# EasyEDA Pro project ProPrj_NRF9151 GILBERTO8_2026-06-28.epro, board PCB1
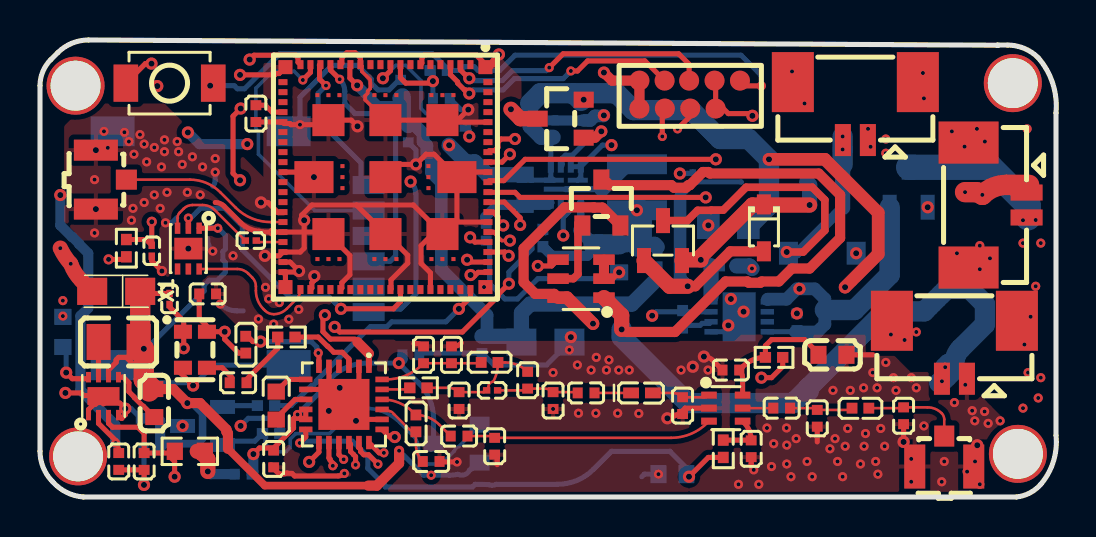
[diagram p2: board, top side]
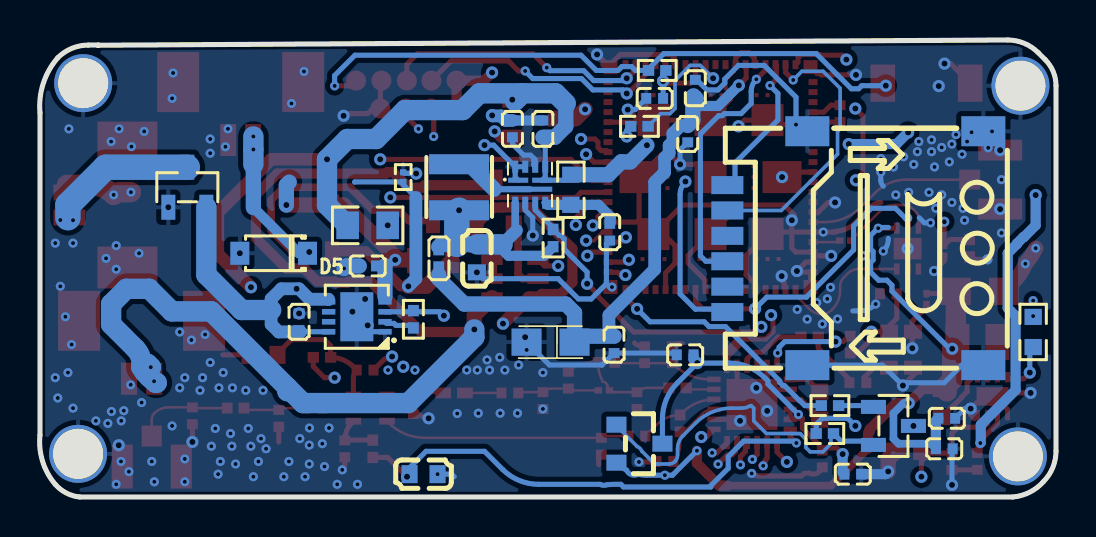
[diagram p3: board, bottom side, seen from below]

Outline 50.8 x 22.86 mm; copper layers: Top Layer, Inner1, Inner2, Bottom Layer. Coordinates in mm from the lower left corner of the outline.
Outline path: 0,20.57 0,2.3 arc(0.17,1.47) 0.64,0.76 arc(1.33,0.23) 2.17,0 48.81,0 arc(49.49,0.2) 50.04,0.64 arc(50.67,1.78) 50.8,3.09 50.8,19.21 arc(50.64,20.68) 49.91,21.97 arc(49.21,22.44) 48.38,22.61 47.88,22.61 47.9,22.6 2.42,22.86 arc(1.59,22.69) 0.89,22.23 0.54,21.88 arc(0.14,21.28) 0,20.57
Stack: Top Layer 0.035mm Outer layer thickness 1oz / Dielectric1 0.2104mm 7628 RC49% 8.6mil / Inner1 0.0152mm Inner layer thickness / Dielectric2 1.065mm 1.1mm H/HOZ Copper / Inner2 0.0152mm Inner layer thickness / Dielectric3 0.2104mm 7628 RC49% 8.6mil / Bottom Layer 0.035mm Outer layer thickness 1oz

## Design rules (mm)
spacing copperThickness1oz (default): track to track 0.102, other pairs 0.094 to 0.3
spacing copperThickness2oz: track to track 0.203, other pairs 0.152 to 0.3
spacing Plane_innerPlane: track to track 0.102, other pairs 0.094 to 0.3
spacing Copper_copperRegion: track to track 0.102, other pairs 0.094 to 0.3
track width copperThickness1oz (default): min 0.127, default 0.254, max 2.54
track width copperThickness2oz: min 0.203, default 0.254, max 2.54
differential pair differentialPair (default): width min 0.127, default 0.254, max 2.54; gap min 0.152, default 0.152
region e1 uses Copper_copperRegion
region e2 uses Copper_copperRegion
region e3 uses Copper_copperRegion
region e4 uses Copper_copperRegion
region e5 uses Copper_copperRegion
region e6 uses Copper_copperRegion
region e7 uses Copper_copperRegion
region e8 uses Copper_copperRegion
region e9 uses Copper_copperRegion
pour e1500 uses Copper_copperRegion
pour e1553 uses Copper_copperRegion
pour e1578 uses Copper_copperRegion
pour e1617 uses Copper_copperRegion
pour e1636 uses Copper_copperRegion

## Placement (name value [footprint] x y rotation side)
C3  15pF  [C0402]  18.03 20.45 270 bottom
C7  10uF  [C0402]  25.65 18.42 270 bottom
C12  10nF  [C0402]  27.18 18.42 270 bottom
C13  10uF  [C0402]  3.94 1.78 90 top
C14  22uF  [C0603]  28.96 11.94 90 bottom
C15  22uF  [C0603]  5.71 4.7 270 top
C17  10nF  [C0402]  5.21 1.78 90 top
C18  10uF  [C0402]  22.31 13.25 90 bottom
C41  10uF  [C0402]  34.42 11.56 180 bottom
C42  10uF  [C0402]  37.85 8.76 270 bottom
C43  10uF  [C0402]  18.54 7.11 0 bottom
C44  100nF  [C0402]  20.07 19.94 180 bottom
C45  4.7uF  [C0402]  10.8 19.18 90 top
C46  4.7uF  [C0402]  22.1 7.62 270 bottom
C47  4.7uF  [C0402]  5.46 3.94 180 bottom
C48  100nF  [C0402]  5.59 2.41 0 bottom
C49  100nF  [C0402]  18.42 18.16 90 bottom
C50  10uF  [CASE-A_3216]  25.27 7.75 0 bottom
C51  10uF  [CASE-A_3216]  3.81 10.29 180 top
C52  15pF  [C0201]  10.54 12.83 0 top
C53  100nF  [C0201]  5.59 12.32 270 top
C54  100nF  [C0201]  6.48 9.91 270 top
C56  1nF  [C0402]  8.38 10.16 0 top
C57  100nF  [C0402]  11.68 1.91 270 top
C76  1nF  [C0402]  20.95 4.83 90 top
C81  1nF  [C0402]  22.73 2.54 90 top
C83  1nF  [C0402]  35.56 2.41 90 top
C85  1nF  [C0402]  34.54 6.35 0 top
C88  10pF  [C0402]  9.91 5.72 0 top
C89  470nF  [C0402]  10.16 1.14 0 bottom
C90  47nF  [C0402]  19.18 7.11 270 top
C91  47pF  [C0402]  20.57 7.11 270 top
C92  3pF  [C0402]  24.38 5.84 270 top
C93  5.6pF  [C0402]  25.65 4.83 90 top
C94  39pF  [C0402]  27.3 5.21 0 top
C95  1.8pF  [C0402]  32.13 4.57 90 top
C96  1.8pF  [C0402]  19.56 1.78 180 top
C97  2.4pF  [C0402]  20.95 3.05 0 top
C98  39pF  [C0402]  37.08 4.45 0 top
C99  3.3pF  [C0402]  38.86 3.94 90 top
C100  3.3pF  [C0402]  43.18 4.06 90 top
C101  NC  [C0603]  31.62 1.14 180 bottom
C102  NC  [C0603]  39.62 7.11 180 top
CARD2  SNO-1305-B  [SIM-SMD_SIM-1305-6P]  10.03 12.45 90 bottom
CN4  A1251WV-S-2P  [CONN-SMD_2P-P1.25_A1251WV-S-2P]  47.88 14.61 270 top
CN5  A1251WV-S-2P  [CONN-SMD_2P-P1.25_A1251WV-S-2P]  40.77 19.3 180 top
CN6  A1251WV-S-2P  [CONN-SMD_2P-P1.25_A1251WV-S-2P]  45.72 7.37 180 top
D5  MBR120LSF  [SOD-123_L2.8-W1.8-LS3.7-RD]  39.12 12.19 0 bottom
D6  BZT52C7V5S  [SOD-323_L1.8-W1.3-LS2.5-RD]  36.2 13.46 270 top
L3  1uH  [IND-SMD_L3.0-W3.0_SWPA3010S]  29.84 15.49 90 bottom
L4  2.2uH  [L0806]  3.93 7.76 180 top
L20  47nH  [L0402]  22.48 6.73 180 top
L21  2.5nH  [L0201]  22.61 5.33 0 top
L22  4.7nH  [L0402-R-RD]  30.1 5.21 0 top
L23  15nH  [L0402]  18.8 3.68 90 top
L24  9.1nH  [L0402]  41.02 4.45 0 top
L26  CBW100505U101T  [L0402]  10.29 7.62 90 top
L27  CBW100505U101T  [L0402]  30.86 11.94 90 bottom
NOREF  -  [Pad_e294]  1.78 20.57 0 top
NOREF#2  -  [Pad_e296]  48.89 2.16 0 top
NOREF#3  -  [Pad_e295]  1.9 2.03 0 top
NOREF#4  -  [Pad_e297]  48.64 20.7 0 top
Q1  AO3407A  [SOT-23_L2.9-W1.3-P1.90-LS2.4-BR]  28.07 14.73 270 top
Q2  AO3407A  [SOT-23_L2.9-W1.3-P1.90-LS2.4-BR]  26.04 18.92 0 top
Q3  AO3407A  [SOT-23_L2.9-W1.3-P1.90-LS2.4-BR]  20.83 2.67 0 bottom
Q6  SI2301  [SOT-23-3_L2.9-W1.3-P1.90-LS2.4-BR]  31.15 12.83 270 top
Q7  MMBT3904  [SOT-23-3_L2.9-W1.3-P1.90-LS2.4-BR]  8.13 3.56 0 bottom
Q8  SI2301  [SOT-23-3_L2.9-W1.3-P1.90-LS2.4-BR]  43.43 15.49 270 bottom
R8  100kΩ  [R0603]  1.14 8.26 270 bottom
R9  100kΩ  [R0603]  24.26 15.37 90 bottom
R11  10kΩ  [R0402]  25.15 12.95 90 bottom
R13  100kΩ  [R0603]  7.49 2.29 0 top
R46  10kΩ  [R0201]  32.64 16 90 bottom
R47  2kΩ  [R0402]  32.13 8.89 270 bottom
R48  470kΩ  [R0805]  34.42 13.59 0 bottom
R49  2.2kΩ  [R0402]  11.3 4.57 180 bottom
R50  22kΩ  [R0402]  11.56 3.17 0 bottom
R51  2kΩ  [R0402]  19.94 21.34 180 bottom
R52  1MΩ  [R0402]  4.32 12.45 270 top
R53  10kΩ  [R0402]  20.83 18.54 180 bottom
R57  220Ω  [R0402]  12.32 8 0 top
R58  0Ω  [R0402]  18.92 5.46 0 top
R59  100Ω  [R0402]  36.7 6.98 180 top
R60  100Ω  [R0402]  34.16 2.41 90 top
RF2  6GHz  [RF-SMD_FRF05002-JSS103M]  3.56 15.88 90 top
RF3  6GHz  [RF-SMD_FRF05002-JSS103M]  45.21 2.29 180 top
SW2  TS-1088-AR02016  [SW-SMD_L3.9-W3.0-P4.45]  6.48 20.7 180 top
U1  nRF9151-LACA-R7  [LGA-113_L12.1-W11.1_NRF9151-LACA-R7]  17.27 16 270 top
U5  LTC4412IS6#TRPBF  [SOT-23-6_L2.9-W1.6-P0.95-LS2.8-BL]  27.05 10.92 90 top
U8  SKY65723-81  [MCM-6_L2.3-W1.7-P0.54-TL-EP]  7.42 12.43 270 top
U9  TPS6209733RWKR  [VQFN-11_L2.0-W2.0-P0.50-TL_TI_RWK]  26.29 15.62 180 bottom
U10  TPS62172DSGR  [WSON-8_L2.0-W2.0-P0.50-TL-EP]  3.17 5.05 90 top
U11  CN3165  [DFN-8_L3.0-W3.0-P0.50-BL-EP]  34.96 9.02 90 bottom
U13  SX1262IMLTRT  [QFN-24_L4.0-W4.0-P0.50-BL-EP2.6]  15.2 4.63 180 top
U14  PE4259-63  [SC-70-6_L2.2-W1.3-P0.65-LS2.1-BL]  34.29 4.45 270 top
U15  15uH  [L0603]  11.81 4.57 90 top
U16  e0493c80bb4246c1b3dcb26663821a15  [J CONNEXCO]  28.7 20.83 0 top
X1  32MHz  [OSC-SMD_4P-L2.0-W1.6-BL_1XXD]  7.75 7.37 270 top

## Footprints (pads in the part's own frame, mm; a bottom-side part is the same pattern mirrored in y, then rotated)
C0201
  rect 0.368x0.324 smd: 1(-0.275,0) 2(0.275,0)
C0402
  rect 0.5x0.54 smd: 1(-0.42,0) 2(0.42,0)
C0603
  rect 0.8x0.9 smd: 1(-0.7,0) 2(0.7,0)
CASE-A_3216
  rect 1.5x1.359 smd: 1(-1.2,0) 2(1.2,0)
CONN-SMD_2P-P1.25_A1251WV-S-2P
  rect 0.8x1.6 smd: 1(-0.626,1.45) 2(0.624,1.45)
  rect 2.1x3 smd: 3(-3.125,-1.45) 4(3.125,-1.45)
DFN-8_L3.0-W3.0-P0.50-BL-EP
  rect 0.28x0.665 smd: 1(-0.75,-1.407) 2(-0.25,-1.407) 3(0.25,-1.407) 4(0.75,-1.407) 5(0.75,1.407) 6(0.25,1.407) 7(-0.25,1.407) 8(-0.75,1.407)
  rect 2.45x1.65 smd: 9(0,0)
IND-SMD_L3.0-W3.0_SWPA3010S
  rect 1x3 smd: 1(1.15,0) 2(-1.15,0)
J CONNEXCO
  round 1 smd: 1(1.27,0) 2(2.529,0) 3(3.756,0) 4(5.026,0) 5(6.295,0) 6(1.27,-1.397) 7(2.54,-1.397) 8(3.81,-1.397) 9(5.08,-1.397)
L0201
  rect 0.368x0.324 smd: 1(-0.275,0) 2(0.275,0)
L0402
  rect 0.54x0.54 smd: 1(-0.42,0) 2(0.42,0)
L0402-R-RD
  rect 0.79x0.54 smd: 1(-0.545,0) 2(0.545,0)
L0603
  rect 0.8x0.864 smd: 1(-0.7,0) 2(0.7,0)
L0806
  rect 1.2x1.8 smd: 1(-1,0) 2(1,0)
LGA-113_L12.1-W11.1_NRF9151-LACA-R7
  rect 0.7x0.7 smd: 1(-5.5,5) 20(-5.5,-5) 41(5.5,-5) 60(5.5,5)
  rect 0.45x0.3 smd: 2(-5.625,4.25) 3(-5.625,3.75) 4(-5.625,3.25) 5(-5.625,2.75) 6(-5.625,2.25) 7(-5.625,1.75) 8(-5.625,1.25) 9(-5.625,0.75) 10(-5.625,0.25) 11(-5.625,-0.25) 12(-5.625,-0.75) 13(-5.625,-1.25) 14(-5.625,-1.75) 15(-5.625,-2.25) 16(-5.625,-2.75) 17(-5.625,-3.25) 18(-5.625,-3.75) 19(-5.625,-4.25) 42(5.625,-4.25) 43(5.625,-3.75) 44(5.625,-3.25) 45(5.625,-2.75) 46(5.625,-2.25) 47(5.625,-1.75) 48(5.625,-1.25) 49(5.625,-0.75) 50(5.625,-0.25) 51(5.625,0.25) 52(5.625,0.75) 53(5.625,1.25) 54(5.625,1.75) 55(5.625,2.25) 56(5.625,2.75) 57(5.625,3.25) 58(5.625,3.75) 59(5.625,4.25)
  rect 0.3x0.45 smd: 21(-4.75,-5.125) 22(-4.25,-5.125) 23(-3.75,-5.125) 24(-3.25,-5.125) 25(-2.75,-5.125) 26(-2.25,-5.125) 27(-1.75,-5.125) 28(-1.25,-5.125) 29(-0.75,-5.125) 30(-0.25,-5.125) 31(0.25,-5.125) 32(0.75,-5.125) 33(1.25,-5.125) 34(1.75,-5.125) 35(2.25,-5.125) 36(2.75,-5.125) 37(3.25,-5.125) 38(3.75,-5.125) 39(4.25,-5.125) 40(4.75,-5.125) 61(4.75,5.125) 62(4.25,5.125) 63(3.75,5.125) 64(3.25,5.125) 65(2.75,5.125) 66(2.25,5.125) 67(1.75,5.125) 68(1.25,5.125) 69(0.75,5.125) 70(0.25,5.125) 71(-0.25,5.125) 72(-0.75,5.125) 73(-1.25,5.125) 74(-1.75,5.125) 75(-2.25,5.125) 76(-2.75,5.125) 77(-3.25,5.125) 78(-3.75,5.125) 79(-4.25,5.125) 80(-4.75,5.125)
  rect 0.2x0.2 smd: 81(-4.1,3.4) 82(-4.1,2.85) 83(-4.1,2.3) 84(-4.1,0.55) 85(-4.1,0) 86(-4.1,-0.55) 87(-4.1,-2.3) 88(-4.1,-2.85) 89(-4.1,-3.4) 90(-0.55,-2.15) 91(0,-2.15) 92(0.55,-2.15) 93(4.1,-3.4) 94(4.1,-2.85) 95(4.1,-2.3) 96(4.1,-0.55) 97(4.1,0) 98(4.1,0.55) 99(4.1,2.3) 100(4.1,2.85) 101(4.1,3.4) 102(0.55,2.15) 103(0,2.15) 104(-0.55,2.15)
  rect 1.6x1.6 smd: 105(-2.85,2.85) 106(-2.85,0) 107(-2.85,-2.85) 109(2.85,-2.85) 110(2.85,0) 111(2.85,2.85) 113(0,0)
  rect 1.6x1.95 smd: 108(0,-3.575) 112(0,3.575)
MCM-6_L2.3-W1.7-P0.54-TL-EP
  rect 0.56x0.275 smd: 1(-1.02,0.54) 2(-1.02,0) 3(-1.02,-0.54) 4(1.02,-0.54) 5(1.02,0) 6(1.02,0.54)
  rect 1.08x1.4 smd: 7(0,0)
OSC-SMD_4P-L2.0-W1.6-BL_1XXD
  rect 0.7x0.9 smd: 1(-0.9,-0.6) 2(0.9,-0.6) 3(0.9,0.6) 4(-0.9,0.6)
Pad_e294
  round 2.901 hole 2.499: 1(0,0)
Pad_e295
  round 2.9 hole 2.5: 2(0,0)
Pad_e296
  round 2.901 hole 2.499: 3(0,0)
Pad_e297
  round 2.901 hole 2.499: 4(0,0)
QFN-24_L4.0-W4.0-P0.50-BL-EP2.6
  rect 0.28x0.665 smd: 1(-1.25,-1.907) 2(-0.75,-1.907) 3(-0.25,-1.907) 4(0.25,-1.907) 5(0.75,-1.907) 6(1.25,-1.907) 13(1.25,1.907) 14(0.75,1.907) 15(0.25,1.907) 16(-0.25,1.907) 17(-0.75,1.907) 18(-1.25,1.907)
  rect 0.665x0.28 smd: 7(1.907,-1.25) 8(1.907,-0.75) 9(1.907,-0.25) 10(1.907,0.25) 11(1.907,0.75) 12(1.907,1.25) 19(-1.907,1.25) 20(-1.907,0.75) 21(-1.907,0.25) 22(-1.907,-0.25) 23(-1.907,-0.75) 24(-1.907,-1.25)
  rect 2.55x2.55 smd: 25(0,0)
R0201
  rect 0.303x0.324 smd: 1(-0.241,0) 2(0.241,0)
R0402
  rect 0.566x0.54 smd: 1(-0.433,0) 2(0.433,0)
R0603
  rect 0.806x0.864 smd: 1(-0.753,0) 2(0.753,0)
R0805
  rect 1.133x1.377 smd: 1(-1,0) 2(1,0)
RF-SMD_FRF05002-JSS103M
  rect 1x1.05 smd: 1(0,-0.762)
  rect 1.05x2.2 smd: 2(-1.475,0.762) 3(1.475,0.762)
SC-70-6_L2.2-W1.3-P0.65-LS2.1-BL
  rect 0.35x0.78 smd: 1(-0.65,-0.84) 2(0,-0.84) 3(0.65,-0.84) 4(0.65,0.84) 5(0,0.84) 6(-0.65,0.84)
SIM-SMD_SIM-1305-6P
  rect 1.5x2.2 smd: 7(-5.85,2.401) 8(5.85,2.401) 9(5.85,-6.399) 10(-5.85,-6.399)
  rect 0.9x1.6 smd: C1(-3.193,6.399) C2(-0.653,6.399) C3(1.887,6.399) C5(-1.923,6.399) C6(0.617,6.399) C7(3.156,6.399)
SOD-123_L2.8-W1.8-LS3.7-RD
  rect 0.95x1.15 smd: 1(-1.692,0) 2(1.692,0)
SOD-323_L1.8-W1.3-LS2.5-RD
  rect 1x0.7 smd: 1(-1.173,0) 2(1.173,0)
SOT-23-3_L2.9-W1.3-P1.90-LS2.4-BR
  rect 1.25x0.7 smd: 1(1,-0.95) 2(1,0.95) 3(-1,0)
SOT-23-6_L2.9-W1.6-P0.95-LS2.8-BL
  rect 0.532x1.072 smd: 1(-0.95,-1.149) 2(0,-1.149) 3(0.95,-1.149) 4(0.95,1.149) 5(0,1.149) 6(-0.95,1.149)
SOT-23_L2.9-W1.3-P1.90-LS2.4-BR
  rect 1x0.8 smd: 1(1.15,-0.95) 2(1.15,0.95) 3(-1.15,0)
SW-SMD_L3.9-W3.0-P4.45
  rect 1.23x1.86 smd: 1(-2.185,0) 2(2.185,0)
VQFN-11_L2.0-W2.0-P0.50-TL_TI_RWK
  rect 1x0.25 smd: 1(-0.6,0.225) 7(0.6,0.225)
  rect 2.2x0.25 smd: 2(0,-0.225)
  rect 0.3x0.6 smd: 3(-0.75,-0.9) 4(-0.25,-0.9) 5(0.25,-0.9) 6(0.75,-0.9) 8(0.75,0.9) 9(0.25,0.9) 10(-0.25,0.9) 11(-0.75,0.9)
WSON-8_L2.0-W2.0-P0.50-TL-EP
  rect 0.521x0.25 smd: 1(-0.95,0.75) 2(-0.95,0.25) 3(-0.95,-0.25) 4(-0.95,-0.75) 5(0.95,-0.75) 6(0.95,-0.25) 7(0.95,0.25) 8(0.95,0.75)
  rect 0.9x1.6 smd: 9(0,0)

## Nets
As in the schematic, except:
GND: C3.1 C7.1 C12.1 C13.1 C14.1 C17.1 C18.1 C41.1 C42.1 C43.2 C44.1 C45.1 C46.2 C47.2 C48.1 C49.1 C50.2 C51.2 C53.2 C54.2 C56.2 C57.2 C76.1 C81.1 C83.1 C85.1 C89.1 C90.1 C91.1 C93.1 C95.1 C96.1 C99.1 C100.1 C101.2 C102.1 CARD2.7 CARD2.8 CARD2.9 CARD2.10 CARD2.C5 CN4.1 CN4.3 CN4.4 CN5.1 CN5.3 CN5.4 CN6.1 CN6.3 CN6.4 D5.2 NOREF.1 NOREF#2.3 NOREF#3.2 NOREF#4.4 Q7.3 Q8.1 R13.2 R46.2 R47.1 R52.2 RF2.2 RF2.3 RF3.2 RF3.3 SW2.2 U1.1 U1.7 U1.13 U1.15 U1.20 U1.25 U1.30 U1.34 U1.36 U1.38 U1.39 U1.40 U1.41 U1.43 U1.46 U1.51 U1.55 U1.60 U1.66 U1.71 U1.76 U1.105 U1.106 U1.107 U1.108 U1.109 U1.110 U1.111 U1.112 U1.113 U5.2 U5.3 U8.7 U9.1 U9.4 U9.10 U9.11 U10.1 U10.4 U10.9 U11.1 U11.3 U11.9 U13.2 U13.5 U13.8 U13.20 U13.25 U14.2 U16.4 U16.9 X1.1 X1.2

Pads without a net: CARD2 C6; U1 2 5 6 8 11 12 21 22 23 26 27 28 29 31 32 33 44 45 47 48 49 50 53 54 56 57 58 74 75 77 78 79 80 81 82 83 84 85 86 87 88 89 90 91 92 93 94 95 96 97 98 99 100 101 102 103 104; U8 4 5; U11 6 7; U13 4

## Via types
v1: diameter 0.61, hole 0.305, Top Layer to Bottom Layer, 105 vias
v2: diameter 0.457, hole 0.203, Top Layer to Bottom Layer, 176 vias
v3: diameter 0.508, hole 0.254, Top Layer to Bottom Layer, 3 vias

## Routing (per net, layer and track width the routed paths; a pad name or vN(x,y) marks a point on that pad's centre or on a via; arc(x,y) is an arc through that point)
3.3V_SYS_2A: length 64.7
  Top Layer w0.254: v1(10.03,19.43) 9.65,19.05 9.65,16.19 v1(10,15.84)
  Top Layer w0.508: v1(28.2,21.23) 28.6,20.83 U16.1 U16.6
  Inner2 w0.254: v1(10.03,3.56) 10.41,3.94 10.41,15.43 v1(10,15.84)
  Inner2 w0.508: 20.38,19.11 20.38,19.43 20.75,19.8 20.75,20.48 20.75,20.48 20.75,21.24 21.17,21.66 22.3,21.66 23.45,20.5 26.71,20.5 27.47,21.26 29.29,21.26 29.53,21.02 29.53,14.66 v1(29.84,14.34)
  Inner2 w0.762: v1(10.03,19.43) 20.07,19.43 v1(21.46,18.03)
  Bottom Layer w0.254: R53.1 21.46,18.34 v1(21.46,18.03) ; v1(10.03,3.56) 10.41,3.94 11.68,3.94 11.99,3.63 R50.2
  Bottom Layer w0.381: U9.3 27.04,13.4 26.98,13.34
  Bottom Layer w0.508: 27.95,12.64 27.37,12.06 25.6,12.06 R11.1
  Bottom Layer w0.635: 26.98,13.34 27.67,12.64
  Bottom Layer w0.762: 30.86,12.51 30.73,12.64 C14.2
  Bottom Layer w1.016: C14.2 27.67,12.64
  Bottom Layer w1.27: v1(29.84,14.34) 29.96,14.23 29.96,12.64
GND: length 180
  Top Layer w0.178: U1.13 16.09,21.56 16.09,21.29 16.51,20.87 16.51,20.43 16.38,20.3 16.38,20.19 16.26,20.07 16.26,19.87 U1.106
  Top Layer w0.254: U13.20 15.95,3.88 U13.25 15.95,5.38 U13.2 ; U1.43 13.59,10.45 13.59,10.72 13.72,10.84 v1(13.72,11.05) ; U1.55 19.52,11.21 19.05,11.68 19.05,12.57 19.63,13.15 20.12,13.15 18.67,14.61 15.82,14.61 ; U1.105 20.22,18.75 U1.76 ; U1.105 20.89,18.85 v1(21.41,19.38) ; U1.105 U1.106 ; 13.21,13.25 13.21,12.45 13.01,12.25 U1.38 11.96,12.06 v1(11.24,12.06) ; 13.21,13.25 U1.36 v2(11.63,13.25) 11.15,13.25 arc(11.12,13.25) 11.09,13.25 arc(11.04,13.26) 11,13.27 10.97,13.29 10.93,13.29 arc(10.45,13.43) 10.03,13.72 9.2,14.55 arc(9,14.69) 8.76,14.73 ; 13.21,13.25 14.32,13.25 15.49,12.08 15.49,11.12 15.09,10.72 15.09,10.45 U1.46 ; 13.21,13.25 13.21,13.72 ; v1(10,21.11) 11.74,21.11 11.81,21.18 11.95,21.18 U1.20 ; U1.51 17.55,10.41 17.55,10.86 18.39,11.7 18.39,12.09 17.37,13.11 17.37,13.05 15.82,14.61 ; U1.41 12.27,11.13 U1.40 12.9,11.25 v1(12.95,11.3) 12.51,11.75 U1.39 ; U16.4 33.78,20.77 U16.9 ; 15.82,14.61 13.59,14.61 13.08,14.1 13.08,13.72 ; 18.7,7.67 18.84,7.67 arc(19.02,7.64) C90.1 ; C53.2 5.59,11.81 v3(6.1,11.3) ; v2(20.85,1.75) 20,1.75 C96.1 ; U10.1 2.42,4.38 2.68,4.64 2.76,4.64 2.98,4.86 ; U1.1 22.52,21.5 22.64,21.63 ; v1(35.62,19.07) 35.51,19.18 34.42,19.18 34.02,19.57 ; C45.1 12.14,18.76 U1.25 12.22,18.68 12.49,18.68 12.54,18.62 v2(13,18.62) 14.2,18.62 U1.107 15.56,18.85 v1(15.87,18.54) ; v1(1.27,5.21) 2.05,5.21 2.18,5.08 2.76,5.08 2.98,4.86 ; v1(5.2,0.61) 5.21,0.61 C17.1 C13.1 ; U1.113 17.91,16.64 v1(18.8,16.64) 19.3,17.15 19.7,17.15 U1.112 ; 22.64,21.63 22.29,21.63 21.79,22.13 19.26,22.13 19.09,21.97 19.09,21.7 U1.7 ; 22.64,21.63 22.64,21.83 v1(22.95,22.14) ; C99.1 38.86,2.76 ; U1.13 16.02,21.95 15.75,22.23 15.35,22.23 15.09,21.97 15.09,21.7 U1.15 ; U1.30 13.45,16.25 v1(13.7,16) ; U1.112 21.1,16.25 U1.71 ; U1.112 20.85,13.88 20.72,13.75 U1.66 ; 2.98,4.86 3.17,4.67 3.21,4.7 3.99,4.7 v1(4.27,4.42) 4.27,4.12 4.09,3.94 4.08,3.94 U10.4 ; 2.98,4.86 U10.9 ; SW2.2 5.27,21.68 v1(5.57,21.68) ; 12.19,14.22 11.91,14.22 11.4,14.73 v1(11.05,14.73) ; 22.86,1.62 22.86,1.81 arc(22.83,1.98) C81.1 ; C100.1 v1(43.18,2.76) ; R52.2 4.19,11.89 v3(3.43,11.89) ; 6.48,9.5 7.19,8.8 v1(7.19,7.44) ; 7.15,6.47 7.02,6.34 7.02,6.21 v1(7.65,5.58) ; U13.5 14.45,5.38 U13.8 ; v1(28.96,11.24) 28.64,10.92 U5.2 ; C85.1 33.63,6.84 arc(33.43,6.98) v1(33.2,7.02) ; C83.1 35.56,1.66 arc(35.59,1.5) v2(35.69,1.36) ; C91.1 20.65,7.53 arc(20.88,7.58) 21.07,7.71 ; C102.1 41.66,7.11 ; U14.2 32.26,4.45 arc(31.85,4.12) v1(31.37,3.94) ; v2(15.22,1.18) arc(15.08,1.09) 14.91,1.05 12.73,1.05 12.6,1.18 arc(12.47,1.18) 12.35,1.2 arc(11.96,1.18) 11.71,1.48 arc(11.63,1.54) 11.56,1.61
  Top Layer w0.508: U5.2 U5.3
  Top Layer w0.762: C51.2 2.07,10.83 arc(1.75,11.22) v2(1.53,11.67) arc(1.25,12.04) v2(1.02,12.45) ; 7.87,2.29 8,2.29 8.39,1.9 v1(8.39,1.28)
  Top Layer w1.016: 49.46,15.61 48.32,15.61 arc(47.67,15.48) v2(47.12,15.11) arc(46.97,15.21) 46.79,15.25 v2(46.25,15.25)
  Bottom Layer w0.254: CARD2.10 4.71,6.6 5.59,5.72 7.52,5.72 v1(7.65,5.58) 8.67,6.6 CARD2.7 ; v1(5.2,0.61) 5.2,2.38 C48.1 ; U11.9 34.21,8.27 U11.1 ; 30.75,1.14 30.21,1.14 30.09,1.02 ; C47.2 4.56,4.42 v1(4.27,4.42) ; C50.2 25.33,6.6 22.69,6.6 C46.2 19.05,7.2 C43.2 ; v1(28.96,11.24) 28.64,10.92 24.89,10.92 23.88,9.91 23.24,9.91 22.48,10.67 ; 22.48,10.67 22.31,10.5 v2(22.2,10.5) ; 22.48,10.67 22.48,12.66 C18.1 ; v1(26.16,13.08) 26.16,13.97 26.54,14.35 U9.4 ; 8.38,12.93 8.38,12.91 arc(8.45,12.58) v2(8.64,12.3) ; v1(18.8,16.64) 18.8,17.36 C49.1 ; v1(31.99,16.18) 32.35,16.18 32.36,16.19 32.59,16.19 R46.2 ; v2(6.27,13.72) 6.58,13.72 6.84,13.97 ; v2(8.76,16.25) 8.76,15.85 arc(8.73,15.68) 8.64,15.55 ; v1(28.58,17.6) 28.12,17.6 U9.11 ; U9.10 U9.11 ; U9.11 27.04,16 U9.1 ; C44.1 21.05,19.38 v1(21.41,19.38) ; 10.16,9.31 9.84,9.31 arc(9.4,9.4) v2(9.02,9.65) ; C3.1 17.96,20.87 17.45,20.36 16.9,20.36 16.56,20.7 16.56,20.9 15.87,21.59 14.59,21.59 13,20 v2(13,18.62) ; U11.3 30.8,9.27 v1(30.61,9.07)
  Bottom Layer w0.508: C89.1 8.53,1.14 v1(8.39,1.28) ; C7.1 C12.1
  Bottom Layer w0.635: v1(28.19,19.09) 28.17,19.06 27.75,19.06 27.52,18.84 C12.1
  Bottom Layer w0.762: v2(35.6,11.43) 35.47,11.56 C41.1
  vias: v1(2.79,17.35) v1(2.79,14.4) v1(5.86,20.55) v1(7.13,3.56) v1(7.42,12.43) v1(13.21,13.84) v1(14.44,4.31) v1(14.99,5.46) v1(15.8,3.81) v1(26.54,8) v1(32.64,6.52) v1(34.42,8.59) v1(34.54,9.91) v1(35.18,9.27) v1(37.85,9.18) v1(40.81,12.19) v1(44.38,14.49) v1(46.86,2.59) v2(2.73,15.88) v2(2.73,13.21) v2(3.2,18.29) v2(3.39,17.47) v2(4.22,18.24) v2(4.45,17.78) v2(4.57,13.84) v2(4.7,17.15) v2(4.65,14.44) v2(5,18.13) v2(5.21,17.65) v2(5.21,14.73) v2(5.33,16.76) v2(5.71,17.48) v2(5.71,15.11) v2(6.07,16.51) v2(6.01,14.44) v2(6.22,17.87) v2(6.22,17.27) v2(6.35,15.24) v2(6.86,17.78) v2(6.93,17.27) v2(7.11,16.64) v2(7.37,15.24) v2(7.62,17.02) v2(8.01,15.11) v2(8.13,16.51) v2(8.76,16.93) v2(9.65,12.06) v2(10.92,8.9) v2(11.27,10.49) v2(11.44,9.91) v2(11.68,8.65) v2(11.97,9.72) v2(12.44,8.89) v2(12.94,9.38) v2(25.65,6.22) v2(25.65,4.41) v2(26.47,7.36) v2(26.87,6.6) v2(26.92,4.19) v2(27.56,6.35) v2(27.79,4.19) v2(27.81,6.98) v2(28.32,6.35) v2(28.45,6.86) v2(28.88,4.19) v2(28.94,6.35) v2(29.46,6.35) v2(29.94,4.18) v2(30.92,1.14) v2(32.05,6.35) v2(33.4,6.35) v2(34.92,0.64) v2(35.94,0.64) v2(36.35,3.45) v2(36.58,1.52) v2(36.69,2.67) v2(37.33,3.45) v2(37.34,2.6) v2(37.34,1.65) v2(37.6,21.29) v2(37.55,1.02) v2(37.81,2.92) v2(38.23,19.69) v2(38.35,1.78) v2(38.61,1.02) v2(39.5,2.41) v2(39.65,5.33) v2(39.75,2.92) v2(39.88,1.78) v2(40.13,1.02) v2(40.26,2.54) v2(40.39,3.43) v2(40.51,5.33) v2(41.02,1.65) v2(41.18,5.46) v2(41.27,3.17) v2(41.21,2.54) v2(41.4,18.42) v2(41.53,17.52) v2(41.64,6.22) v2(41.78,1.78) v2(41.85,5.46) v2(41.89,1.14) v2(42.04,3.43) v2(42.29,17.91) v2(42.29,17.2) v2(42.29,6.73) v2(42.23,2.54) v2(42.55,8.13) v2(42.67,5.97) v2(42.8,5.33) v2(43.23,7.85) v2(43.56,5.97) v2(43.56,1.91) v2(43.56,0.76) v2(43.81,8.26) v2(43.81,5.46) v2(44.15,21.21) v2(44.2,19.94) v2(44.2,3.56) v2(45.08,0.76) v2(45.21,1.78) v2(45.59,18.29) v2(45.72,4.72) v2(45.85,12.19) v2(46.23,17.53) v2(46.26,5.61) v2(46.36,1.27) v2(46.61,4.32) v2(46.74,3.81) v2(46.75,1.78) v2(46.85,18.42) v2(46.99,12.57) v2(46.99,11.39) v2(46.99,0.64) v2(47.24,17.78) v2(47.23,4.28) v2(47.5,11.94) v2(47.41,3.68) v2(48.01,3.81) v2(49.15,12.7) v2(49.15,4.45) v2(49.22,7.63) v2(49.36,18.42) v2(49.4,6.22) v2(49.53,9.02) v2(49.78,10.54) v2(49.91,4.95) v2(50.04,12.7) v2(50.04,5.97)
VBAT: length 36.2
  Top Layer w0.762: Q2.3 24.02,18.92 v1(23.55,19.39)
  Inner2 w0.762: v1(23.55,19.39) 23.66,19.39 26.16,16.89 26.16,14.48 27.94,12.7 35.69,12.7 v1(37.97,10.41)
  Bottom Layer w0.254: C42.2 37.77,8.27 U11.8
  Bottom Layer w0.635: 37.77,8.27 38.02,8.27 38.03,8.26 38.86,8.26 39.24,8.64 39.24,9.91 38.73,10.41 37.85,10.41 37.33,9.89 36.39,9.89 36.37,9.88
  Bottom Layer w1.016: Q8.2 42.48,11.12 40.72,9.35 39.24,9.35
VDD_SX126: length 29.7
  Top Layer w0.254: 12.7,3.94 12.68,3.91 12.68,3.45 11.68,2.45 10.97,2.45 v1(10.67,2.15) ; 12.7,3.94 12.86,4.1 arc(12.9,4.1) v2(12.88,4.13) ; 12.7,3.94 13.23,3.94 U13.11 U13.10 ; v1(14.24,9.1) 14.15,9 14.15,8.27 14.52,7.9 15.75,7.9
  Top Layer w0.305: U13.1 16.45,7.18
  Top Layer w0.508: 16.45,7.18 15.87,7.75
  Inner2 w0.508: v1(10.67,2.15) 10.67,2.8 11.81,3.94 11.81,7.37 13.32,8.88 13.44,8.88 13.66,9.1 v1(14.24,9.1)
  Bottom Layer w0.254: v2(12.88,4.13) 14.4,5.65 14.4,5.8 14.55,5.95 arc(15.38,6.51) 16.35,6.7 v1(17.94,6.7) 18.93,5.7 arc(19.48,4.88) 19.68,3.91 Q3.3
  Bottom Layer w0.508: C89.2 10.67,1.23 v1(10.67,2.15) ; v1(17.94,6.7) 18.12,6.88 C43.1
VIN: length 105.1
  Top Layer w0.178: C13.2 3.94,2.48 3.78,2.63 v2(3.78,2.7)
  Top Layer w0.254: v2(3.78,2.7) 3.78,2.82 2.92,3.68 U10.2
  Top Layer w0.508: U5.6 25.71,10.16 24.77,10.16 24.18,10.74 24.18,12.43 26.24,14.49 27.68,14.49 27.7,14.48 28.12,14.48 29.02,13.58
  Top Layer w0.635: U5.6 26.35,9.97 v1(27.65,8.67) ; v1(36.45,16.89) 39.24,16.89 41.91,14.22 41.91,12.15 v1(40.25,10.5)
  Inner2 w0.508: v1(7.39,18.23) 7.2,18.42 arc(6.65,18.79) 6,18.92 3.94,18.92 arc(3.78,18.95) 3.62,18.92 2.92,18.92 1.94,17.94 arc(1.91,17.9) 1.9,17.86 1.02,16.97 v1(1.02,15.1)
  Inner2 w0.635: v1(40.25,10.5) 37.57,7.81 32.7,7.81 32,7.11 29.21,7.11 v1(27.65,8.67)
  Inner2 w0.762: v1(20.46,17.59) 10.42,17.59 v1(10.36,17.65)
  Bottom Layer w0.254: C7.2 25.54,17.88 U9.8 25.54,16 U9.7 24.53,15.85 R9.2
  Bottom Layer w0.508: v1(7.39,18.23) 7.98,17.65 v1(10.36,17.65) ; v2(3.78,2.7) 3.76,2.72 3.76,3.61 2.02,5.35 2.02,9.06 2.41,9.45 2.41,12.19 1.96,12.65 1.96,12.68 1.63,13 1.6,13 1.02,13.59 v1(1.02,15.1)
  Bottom Layer w0.762: R9.2 22.38,16.12 21.74,16.76 21.29,16.76 v1(20.46,17.59) ; 24.51,19.69 24.51,18.54 25.06,18 C7.2
  Bottom Layer w1.016: R48.2 35.43,13.59 36.45,14.61 v1(36.45,16.89) 35.43,17.91 34,17.91 32.55,19.35 29.67,19.35 28.83,20.19 26.67,20.19 ; 26.67,20.19 27.05,19.81 ; 26.67,20.19 25.02,20.19 24.51,19.69
  vias: v1(27.18,19.87)
ANT_SW: length 26.3
  Top Layer w0.254: v1(23.75,17.91) 23.05,17.91 22.9,17.76 22.9,17.49 22.74,17.32 22.47,17.32 U1.73 ; v1(36.07,5.97) 36.58,5.97 37.14,6.53 R59.1
  Inner2 w0.254: v1(36.07,5.97) 35.94,5.84 26.8,5.84 25.96,6.68 25.96,7.89 25.37,8.47 25.37,11.21 25.48,11.31 25.48,12.48 24.59,13.37 24.59,14.25 24.08,14.76 24.08,17.39 23.74,17.73 23.74,17.9 v1(23.75,17.91)
BUSY: length 25.4
  Top Layer w0.254: U1.68 23.22,14.75 24.01,13.97 v1(24.01,13.61) ; U13.14 14.45,1.95 14.5,1.9 14.5,1.84 14.76,1.58 14.66,1.58 v2(14.64,1.56)
  Inner2 w0.254: v2(14.64,1.56) 14.48,1.56 13.86,2.18 13.86,5.22 17.78,9.14 17.78,13.21 19.93,15.37 22.13,15.37 22.67,14.83 22.86,14.83 23.49,14.21 23.49,14.08 23.74,13.83 23.74,13.62 23.75,13.61 v1(24.01,13.61)
COEX0: length 20.2
  Top Layer w0.254: v1(15.05,9.41) 17.67,9.41 18.02,9.77 U1.52 ; v3(5.59,13.77) C53.1 5.3,12.88 R52.1 ; U8.2 v2(7.42,13.95)
  Inner2 w0.254: v3(5.59,13.77) 5.59,13.59 5.97,13.21 7.11,13.21 7.42,13.51 v2(7.42,13.95)
  Bottom Layer w0.254: v2(7.42,13.95) 7.54,13.95 8.03,14.44 9.23,14.44 10.12,13.56 10.12,12.36 12.48,10 14.46,10 v1(15.05,9.41)
DEB_RX: length 20.1
  Top Layer w0.254: 31.24,19.69 31.11,19.56 v2(31.11,18.03) ; U1.69 22.41,15.24 23.75,15.24 24,14.99 v1(33.28,14.99)
  Inner2 w0.254: v2(31.11,18.03) 31.37,17.78 33.73,17.78 34.38,17.13 34.38,16.71 34.39,16.69 34.39,14.75 34.14,14.49 33.78,14.49 v1(33.28,14.99)
DEB_TX: length 20.1
  Top Layer w0.254: v2(31.88,18.41) 32.51,19.05 32.51,19.69 ; U1.70 22.47,15.82 23.19,15.82 24.26,16.89 v1(33.79,16.89)
  Inner2 w0.254: v2(31.88,18.41) 31.45,18.41 30.94,18.92 30.61,18.92 30.23,18.54 30.23,17.78 31.11,16.89 v1(33.79,16.89)
DI01: length 23.2
  Top Layer w0.254: U1.72 23.1,16.75 23.37,17.02 ; U13.13 13.95,2.25 v1(13.46,1.76)
  Inner2 w0.254: v1(13.46,1.76) 13.46,1.76 13.46,2.46 13.49,2.49 13.49,2.91 13.46,2.94 13.46,5.84 17.27,9.65 17.27,13.21 21.21,17.15 v1(23.49,17.15)
DI03: length 4.7
  Top Layer w0.254: 10.41,8.04 10.41,8 10.64,7.77 v1(11.03,7.77) ; U13.6 13.95,7.17 v2(13.92,7.2)
  Bottom Layer w0.254: v1(11.03,7.77) 13.56,7.77 13.84,7.49 13.84,7.28 v2(13.92,7.2)
DIO2: length 25.1
  Top Layer w0.254: R60.1 33.41,1.98 v1(32.45,1.02) ; v2(12.98,2.7) 13.29,3.01 U13.12
  Bottom Layer w0.254: v1(32.45,1.02) 32.45,1.33 31.5,2.29 28.58,2.29 27.67,1.38 arc(26.84,0.83) 25.87,0.64 22.81,0.64 arc(22.63,0.59) 22.44,0.62 arc(22.1,0.63) 21.76,0.64 21.62,0.5 17.26,0.5 17.26,0.57 16.39,1.44 16.39,2.03 15.62,2.79 13.08,2.79 v2(12.98,2.7)
ENABLE: length 6.4
  Top Layer w0.254: v1(17.14,20.95) 17.52,21.32 U1.10
  Bottom Layer w0.178: v1(17.14,20.95) 17.79,21.59 18.29,21.59 19.05,20.83 19.05,19.43 19.3,19.18 19.76,19.18 R53.2
ENABLE_3.3VGPIO: length 35
  Top Layer w0.254: v1(14.73,8.51) 14.99,8.26 21.12,8.26 22.9,10.04 22.9,10.12 v1(23.44,10.67) ; v1(6.73,1.02) 6.73,1.78 6.48,2.03 ; U10.3 3.43,4.09 3.43,3.68 3.62,3.49 4.89,3.49 5.21,3.17 C17.2 6.53,2.2 arc(6.64,2.22) R13.1
  Inner2 w0.254: v1(14.73,8.51) 13.97,8.51 12.32,6.86 12.32,2.97 9.86,0.51 7.49,0.51 6.98,1.02 v1(6.73,1.02)
  Bottom Layer w0.254: v1(23.44,10.67) 23.44,11.25 24.6,12.41 24.6,12.92 24.76,13.08 24.84,13.08 R11.2 ; U9.5 26.04,14.36 25.27,13.59 25.27,13.21
GPIO3V3_LORA_500MA: length 66.3
  Top Layer w0.178: v1(23.49,12.83) 23.09,12.83 22.66,13.25
  Top Layer w0.254: 6.48,10.09 6.39,10.18 5.37,10.18 5.26,10.29 C51.1 ; U10.6 3.42,6.36 3.81,6.74 3.81,6.86 3.93,6.98 4.32,6.98 4.57,6.73 ; 22.66,13.25 U1.65 ; U8.1 v2(8.89,13.45)
  Top Layer w0.381: 9.4,2.41 11.24,0.57 16.41,0.57
  Top Layer w0.508: 9.4,2.41 9.4,3.19 9.32,3.26 9.32,3.38 8,4.7 v1(7.37,4.7) 6.67,5.4 C15.1 ; 16.41,0.57 16.84,0.57 17.95,1.68 v2(17.95,2.31)
  Top Layer w1.016: C51.1 5.01,7.6 v1(5.19,7.41) 5.19,5.86 5.59,5.46 ; 5.59,5.42 5.45,5.28
  Inner2 w0.254: v1(23.49,12.83) 23.75,12.83 24.26,12.32 24.26,6.59 19.56,1.9 19.56,1.14 ; v2(1.14,9.05) v2(1.14,9.82)
  Inner2 w0.508: v1(5.19,7.41) 5.18,7.41 3.58,9.02 1.02,9.02
  Bottom Layer w0.254: v1(5.19,7.41) 5.32,7.41 8.2,10.3 8.2,10.59 8.46,10.85 8.87,10.85 9.27,11.25 9.27,11.73 9.14,11.85 9.14,12.28 9.27,12.4 9.27,13.08 8.91,13.45 v2(8.89,13.45) 8.85,13.48 8.38,13.48 ; v2(17.95,2.31) 19.18,1.09 v2(19.56,1.09) 20.47,1.09 arc(20.68,1.1) 20.9,1.13 arc(21.23,1.12) 21.47,1.34 arc(21.74,1.51) Q3.2
  Bottom Layer w0.381: v1(7.37,4.7) 7.62,4.7 8.13,4.19 8.13,2.92 7.87,2.67 6.26,2.67 C48.2
  Bottom Layer w0.508: C48.2 6.01,3.81 C47.1
LORA_VOLTAGE_ENABLE: length 12.5
  Top Layer w0.254: U1.59 21.52,9.99 v1(20.94,9.41)
  Bottom Layer w0.254: R49.1 12.56,4.57 12.8,4.81 12.81,4.81 13.57,5.57 13.65,5.57 13.81,5.73 13.81,5.81 16.52,8.52 17.35,8.52 17.59,8.76 20.3,8.76 v1(20.94,9.41)
MISO: length 18.8
  Top Layer w0.254: U13.16 15.53,2.64 15.53,2.28 15.67,2.13 15.67,2.13 15.78,2.02 v2(15.78,1.61) ; v1(21.36,11.87) 21.47,11.75 U1.62
  Inner2 w0.254: v2(15.78,1.61) 16.37,1.02 18.17,1.02 22.73,5.57 22.73,11.3 22.17,11.87 v1(21.36,11.87)
MOSI: length 17.9
  Top Layer w0.254: U13.17 15.95,2.47 16.03,2.39 16.03,2.28 16.19,2.11 16.43,2.11 v2(16.9,1.65) ; v1(21.51,12.99) 21.74,12.75 U1.64
  Inner2 w0.254: v2(16.9,1.65) 16.38,2.16 16.38,4.31 19.56,7.49 19.56,12.95 20.19,13.59 20.91,13.59 v1(21.51,12.99)
NRESET: length 20.7
  Top Layer w0.254: U13.15 14.95,2.12 v2(15.18,1.88) ; v1(23.16,13.58) 22.9,13.84 22.9,14.02 22.67,14.25 U1.67
  Inner2 w0.254: v2(15.18,1.88) 15.18,3.91 15.03,4.07 15.03,4.61 18.8,8.38 18.8,13.34 20.19,14.73 22.26,14.73 23.16,13.84 v1(23.16,13.58)
NRF9151-VDD: length 29
  Top Layer w0.254: v1(15.86,20.59) 15.49,20.95 15.49,21.46
  Bottom Layer w0.508: 17.91,19.56 16.89,19.56 v1(15.86,20.59)
  Bottom Layer w0.635: C46.1 22.35,8.29 22.35,9.1 20.07,11.38 20.07,15.75 19.57,16.24 19.57,16.96 19.34,17.19 19.34,17.59 19.15,17.77 19.15,18.19 18.76,18.58 C49.2
  Bottom Layer w0.762: 30.86,11.11 30.86,10.92 29.59,9.65 24.51,9.65 24.07,9.21 24.07,7.75 23.78,8.04 C46.1 ; 18.16,20.03 18.16,18.84 C49.2 ; 18.12,20.07 17.99,19.94
NSS: length 11.4
  Top Layer w0.254: U1.61 22.38,11.24 21.91,11.24 21.73,11.06 21.57,11.06 v1(21.53,11.1) ; v1(17.74,3) 17.48,3 U13.19
  Inner2 w0.254: v1(17.74,3) 21.53,6.79 v1(21.53,11.1)
RESET: length 32.5
  Top Layer w0.254: v1(8.51,20.57) 8.39,20.46 8.39,20.2 arc(8.58,20.49) 8.65,20.83 ; U16.5 35.26,20.56 v2(36.07,20.56)
  Bottom Layer w0.254: 36.07,20.57 36.07,21.08 35.05,22.1 23.75,22.1 22.99,21.34 21.9,21.34 21.71,21.53 21.22,21.53 21.03,21.34 R51.1 20.37,21.42 19.61,22.18 11.99,22.18 10.23,20.42 9.87,20.42 9.72,20.57 v1(8.51,20.57)
RF_ANT: length 8.5
  Top Layer w0.127: RF2.1 7.49,15.88 arc(8.31,15.71) 9.01,15.25 9.78,14.48 arc(10.58,13.94) 11.53,13.75 U1.35
RF_AUX: length 1.4
  Top Layer w0.127: U1.37 11,12.75 arc(10.9,12.77) C52.2
RF_GPS: length 7.1
  Top Layer w0.127: U8.6 9.86,11.41 arc(10.16,11.35) 10.41,11.18 10.62,10.97 arc(10.75,10.78) 10.8,10.54 10.8,10.32 arc(10.89,9.82) 11.18,9.4 11.25,9.32 arc(11.45,9.19) 11.68,9.14 arc(12.04,9.21) 12.33,9.41 12.83,9.91 arc(12.97,10.12) U1.42
SCK: length 17.2
  Top Layer w0.254: v2(17.19,2.21) 16.96,2.21 U13.18 ; 23.26,12.24 v1(23.43,12.07) ; U1.63 23.24,12.25 23.25,12.24
  Inner2 w0.178: 20.45,12.45 20.47,12.43 23.07,12.43 v1(23.43,12.07)
  Inner2 w0.254: 20.45,12.45 20.19,12.19 20.19,7.11 16.76,3.68 16.76,2.64 v2(17.19,2.21)
SIM_CLK: length 13.8
  Top Layer w0.254: v2(13.14,20.86) 13.52,21.24 U1.18
  Bottom Layer w0.178: CARD2.C3 13.73,14.33 10.92,17.15 10.92,18.29 10.8,18.42 10.8,20.45 11.64,21.29 12.71,21.29 v2(13.14,20.86)
SIM_IO: length 7.3
  Top Layer w0.254: 13.97,21.6 13.98,21.6 13.98,20.9 v2(14.3,20.58)
  Bottom Layer w0.254: CARD2.C7 16.05,15.98 16.05,16.71 13.91,18.85 13.91,20.19 v2(14.3,20.58)
SIM_RST: length 12.8
  Top Layer w0.254: v2(14.98,20.9) 14.53,21.35 14.53,21.54
  Bottom Layer w0.254: CARD2.C2 17.51,11.79 17.78,12.06 17.78,18.16 16.87,19.08 16.69,19.08 16.59,19.18 15.75,19.18 15.24,19.69 15.24,20.28 arc(15.17,20.61) v2(14.98,20.9)
SIM_VCC: length 27.5
  Top Layer w0.254: U1.19 12.9,21.75 12.9,21.97 12.74,22.13 11.81,22.13 11.77,22.1 10.7,22.1 v1(10.48,21.88)
  Inner2 w0.254: v1(18.53,15.78) 17.39,14.64 12.29,14.64 9.14,17.78 9.14,21.08 9.94,21.88 v1(10.48,21.88)
  Bottom Layer w0.254: CARD2.C1 16.58,9.4 18.03,9.4 18.8,10.16 18.8,15.14 arc(18.73,15.48) v1(18.53,15.78)
SOLAR_PV: length 11.4
  Top Layer w0.762: Q6.2 32.14,11.86 v1(33.04,11.86) 33.04,12.03 35.62,14.61 v1(38.48,14.61)
  Bottom Layer w0.254: C41.2 33.35,11.56 v1(33.04,11.86)
  Bottom Layer w0.762: v1(38.48,14.61) 38.48,15.61 38.34,15.75 ; 33.55,10.03 33.55,11.55 33.55,11.56
SWDCLK: length 13.3
  Top Layer w0.254: v2(25.46,21.48) 26.16,22.17 31.93,22.17 32.46,21.64 32.46,21.08 ; U1.3 21.02,21.36 21.26,21.12 21.29,21.12 v1(21.46,20.95)
  Bottom Layer w0.254: v2(25.46,21.48) 25.31,21.32 23.61,21.32 23.12,20.83 21.58,20.83 v1(21.46,20.95)
SWDIO: length 12.7
  Top Layer w0.254: v1(21.46,20.18) 21.29,20.36 21.22,20.36 20.88,20.7 20.88,20.77 20.52,21.12 U1.4 ; v2(26.54,21.31) 26.88,21.31 27.38,21.81 30.24,21.81 U16.2
  Bottom Layer w0.254: v1(21.46,20.18) 21.64,20.36 23.15,20.36 23.72,20.93 26.16,20.93 v2(26.54,21.31)
$1N5599: length 2.5
  Bottom Layer w0.254: 26.11,16.59 26.11,16.66 26.04,16.73 U9.9 ; C12.2 27.18,17.66 26.62,17.1 26.27,17.1 26.11,16.94 ; 26.11,16.94 26.04,16.87 26.04,16.74 26.11,16.81 26.11,16.94
$1N5840: length 4.1
  Bottom Layer w0.305: 29.34,16.64 L3.1 ; 26.29,15.4 28.1,15.4
  Bottom Layer w0.762: 28.1,15.4 29.34,16.64
$1N6280: length 2.9
  Top Layer w0.254: C15.2 5.17,4.54 5.15,4.54 4.72,4.98 4.72,5 4.45,5.27 4.45,5.72 4.16,6 U10.5
$1N6332: length 2.6
  Top Layer w0.254: U10.8 2.35,5.92 1.61,5.92 v1(1.31,6.22)
  Bottom Layer w0.254: R8.2 1.31,7.34 v1(1.31,6.22)
$1N6408: length 1.8
  Top Layer w0.254: U10.7 2.92,7.75 L4.2
$1N6706: length 3.7
  Bottom Layer w0.254: U9.6 25.61,14.72
  Bottom Layer w0.508: 22.26,13.72 22.26,14.01 22.87,14.61 R9.1 ; 24.38,14.61 25.43,14.61
$1N7225: length 7.7
  Top Layer w0.254: v2(49.15,13.84) 49.16,13.85 49.46,13.85
  Bottom Layer w1.27: Q8.3 47.51,16.49 49.4,14.61 49.4,13.97
  vias: v2(49.79,13.85)
$1N7651: length 20.1
  Top Layer w0.381: Q6.3 32.37,13.83 32.88,14.34 33.55,14.34 33.56,14.35 34.16,14.35 35.31,15.49 38.61,15.49 39.24,14.86 39.24,13.34 38.16,12.26 v1(37.34,12.26)
  Bottom Layer w0.508: 40.13,14.48 37.85,12.19 D5.1
  Bottom Layer w0.762: 40.13,14.48 40.13,16.64
  Bottom Layer w1.016: 40.13,16.64 v2(40.13,17.38) v2(40.13,18.03)
$1N7654: length 15.3
  Top Layer w0.508: D6.2 34.51,12.29 32.77,10.54 v1(32.39,10.54)
  Top Layer w0.762: v1(32.39,10.54) 31.48,10.54 Q6.1
  Bottom Layer w0.254: 35.07,15.75 35.06,15.76 R46.1 32.64,15.62 32,14.99
  Bottom Layer w0.635: 32,14.99 32,10.92 v1(32.39,10.54)
$1N7658: length 1.4
  Bottom Layer w0.254: U11.2 33.47,8.69 33.1,8.69 33,8.58 32.26,8.58
$1N7845: length 58.5
  Top Layer w0.508: Q1.3 28.19,15.88 28.48,15.6 31.57,15.6 31.7,15.47 32.29,15.47 32.41,15.6 32.49,15.6 33.15,16.26 33.42,16.26 33.5,16.18 38.94,16.18 40.01,15.11 40.01,12.95 38.48,11.43 37.59,11.43 36.94,10.78 36.08,10.78 36.02,10.72 35.43,10.72 35.37,10.78 34.28,10.78 31.75,8.26 29.34,8.26 29.21,8.38 v1(29.08,8.38)
  Top Layer w0.762: U5.1 29.08,9.09 v1(29.08,8.38)
  Bottom Layer w1.016: 45.73,6.49 v2(45.26,6.49) 45.43,6.66 45.72,6.66 arc(45.8,7.08) 46.04,7.43 47.24,8.64 47.24,9.65 46.48,10.41 45.34,10.41 44.21,9.29 42.24,9.29 38.44,5.49 ; 38.44,5.49 37.65,4.7 32.39,4.7 29.08,8 v1(29.08,8.38) ; 38.44,5.49 38.44,5.29 ; 44.96,5.72 45.02,5.72 v2(45.1,5.79) arc(45.35,6) 45.57,6.25 arc(45.66,6.37) 45.73,6.49
$1N7884: length 3.6
  Top Layer w0.381: 26.9,13.71 26.9,11.15 26.67,10.92 U5.5
$1N7906: length 46.4
  Top Layer w0.254: U5.4 25.59,11.56 v1(24.89,11.56)
  Top Layer w0.508: 27.18,17.97 27.75,17.97 v1(28.07,18.29)
  Inner2 w0.508: v1(28.07,18.29) 27.69,17.91 27.69,15.37 29.46,13.59 v1(33.42,13.59) 38.41,13.59 41.15,10.85 41.15,9.02 36.96,4.83 26.13,4.83 24.89,6.07 v1(24.89,11.56)
$1N8450: length 1.8
  Bottom Layer w0.254: R49.2 9.19,4.57 Q7.1
$1N10304: length 17.6
  Bottom Layer w0.178: R50.1 11.25,3.05 11.25,2.67 11.66,2.26 12.29,2.26 12.51,2.48 12.51,2.9 12.79,3.17 13.2,3.17 13.21,3.17 14.48,3.17 15.11,3.81 15.11,4.45 15.24,4.57 15.28,4.57 arc(15.49,4.48) 15.73,4.45 16.22,4.45 arc(17.19,4.25) 18.02,3.7 18.65,3.06 arc(18.85,2.77) 18.92,2.41 18.92,2.08 arc(18.96,1.92) 19.05,1.78 arc(19.19,1.68) 19.36,1.65 19.92,1.65 arc(20.05,1.68) 20.17,1.75 20.71,2.3 arc(20.8,2.44) 20.94,2.53 21.94,3.53 arc(21.97,3.57) Q3.1
  Bottom Layer w0.254: R50.1 10.74,2.79 9.32,2.79 9.13,2.61
$1N10488: length 3.9
  Top Layer w0.254: v1(19.65,20.8) 19.55,20.7 18.29,20.7 18.02,20.97 U1.9
  Bottom Layer w0.254: R51.2 19.65,21.2 v1(19.65,20.8) C44.2
$1N10935: length 1.5
  Top Layer w0.254: U1.24 11.61,19.25 11.26,19.6 C45.2
$1N12604: length 4.9
  Top Layer w0.127: C52.1 8.74,14.35 arc(8.46,14.54) 8.13,14.61 7.62,14.61 arc(7.39,14.56) 7.19,14.43 6.98,14.22 arc(6.91,14.11) 6.88,13.97 U8.3
$1N15358: length 3.5
  Top Layer w0.254: R57.2 13.91,8 14.37,7.54 14.38,7.54 14.69,7.24 15.11,7.24 15.45,6.91 U13.3
$1N15364: length 3
  Top Layer w0.254: C88.2 10.33,5.8 10.29,5.84 11.89,7.44 R57.1
$1N15368: length 1.5
  Top Layer w0.254: 8.35,6.47 9.11,6.47 9.61,5.97
$1N15674: length 1.9
  Top Layer w0.254: 11.68,5.15 12.42,5.88 U13.7
$1N15679: length 2.1
  Top Layer w0.254: 11.68,3.75 11.68,3.81 12.76,4.88 U13.9
$1N16005: length 1.4
  Top Layer w0.127: R58.1 18.41,5.38 U13.23
$1N16052: length 5.2
  Top Layer w0.127: U13.24 17.31,5.88 arc(18.29,6.07) 19.11,6.62 C90.2 C91.2 21.96,6.69 arc(22.02,6.7) L20.2
$1N16301: length 6.3
  Top Layer w0.127: R58.2 20.44,5.46 arc(20.72,5.41) C76.2 22.12,5.25 arc(22.23,5.27) L21.1 arc(22.37,5.38) 22.42,5.42 22.42,5.5 arc(22.49,5.68) 22.66,5.77 arc(22.84,6.22) 22.9,6.7 L20.1 23.25,6.73 arc(23.86,6.61) C92.1
$1N16358: length 4.1
  Top Layer w0.127: L21.2 24.17,5.33 arc(24.29,5.36) C92.2 25.23,5.42 arc(25.46,5.38) C93.2 26.79,5.25 arc(26.84,5.24) C94.1
$1N16409: length 1.8
  Top Layer w0.127: C94.2 L22.1
$1N16412: length 2.9
  Top Layer w0.127: L22.2 31.61,5.21 arc(31.89,5.15) C95.2 33.2,4.99 arc(33.34,5.02) U14.1
$1N16561: length 3.7
  Top Layer w0.127: U13.21 arc(17.29,4.36) 17.48,4.3 arc(17.59,4.25) 17.67,4.17 arc(17.7,4.15) 17.72,4.13 18.43,3.42 arc(18.6,3.3) L23.1 18.8,2.6 arc(18.88,2.16) C96.2
$1N16740: length 12.3
  Top Layer w0.127: C97.2 22.52,3.05 arc(22.64,3.03) C81.2 31.56,2.96 arc(32.54,3.15) 33.36,3.7 U14.3
$1N16747: length 4
  Top Layer w0.127: C97.1 19.96,3.62 arc(19.43,3.98) L23.2 18.66,4.23 arc(17.95,4.71) U13.22
$1N17013: length 6.5
  Top Layer w0.254: C102.2 38.92,7.18 38.23,7.87 36.58,7.87 36.27,7.57 R59.2 arc(35.65,6.86) 35.12,6.51 C85.2 arc(35.09,6.17) 35.13,5.95 U14.6
$1N17155: length 1.5
  Top Layer w0.127: U14.5 C98.1
$1N17206: length 3.1
  Top Layer w0.127: C98.2 38.65,4.45 arc(38.76,4.42) C99.2 40.39,4.36 arc(40.5,4.38) 40.6,4.45
$1N17209: length 4.9
  Top Layer w0.127: RF3.1 45.21,3.88 arc(45.18,4.05) 45.08,4.19 arc(44.76,4.41) 44.38,4.48 C100.2 arc(43.14,4.46) 43.09,4.45 L24.2
$1N17526: length 4.5
  Top Layer w0.254: 8.24,8.65 7.96,8.93 C56.1 ; 8.24,8.65 8.22,8.65 ; 8.24,8.65 8.62,8.27 v1(9.24,8.27) 9.24,7.89 9.93,7.2 L26.1
$1N35658: length 2.5
  Top Layer w0.254: U14.4 35.18,3.74 arc(35.46,3.32) C83.2 arc(35.55,2.84) 35.53,2.85 R60.2

## Copper pours and planes (outline as drawn; the poured copper is in the pictures)
GND on Top Layer: 22.92,22.1 24.07,20.95 24.07,9.89 23.01,8.83 11.81,8.83 11.44,9.19 11.44,10.75 11.16,11.03 11.16,21.72 11.54,22.1
GND on Top Layer: 49.15,0.38 49.15,2.95 45.85,6.26 43.53,6.26 41.66,8.13 35.05,8.13 34.73,7.81 17.78,7.81 17.11,8.48 11.51,8.48 9.46,6.42 9.46,1.97 9.52,1.91 9.52,1.4 11.56,-0.63 48.13,-0.63
GND on Top Layer: 13.59,12.32 14.54,11.36 14.54,9.85 12.94,8.24 10.17,8.24 7.93,10.48 6.88,10.48 4.53,12.83 2.16,12.83 1.21,13.78 1.21,18.55 2.34,19.69 6.22,19.69 8.26,17.65 9.52,17.65 12.52,14.66 12.52,14.64 13.59,13.56
GND on Bottom Layer: -3.3,29.84 57.66,29.84 57.66,-5.71 -3.3,-5.71
GND on Inner1: 0.26,22.6 50.56,22.6 50.56,0.26 0.26,0.26
GND on Inner2: -3.68,27.31 56.01,27.31 56.01,-5.33 -3.68,-5.33

Small or netless copper shapes (teardrops, artwork), in the pictures only: 8 on Inner1
